# Altium schematic sheet SixAxIMU_XSens.SchDoc
size A4
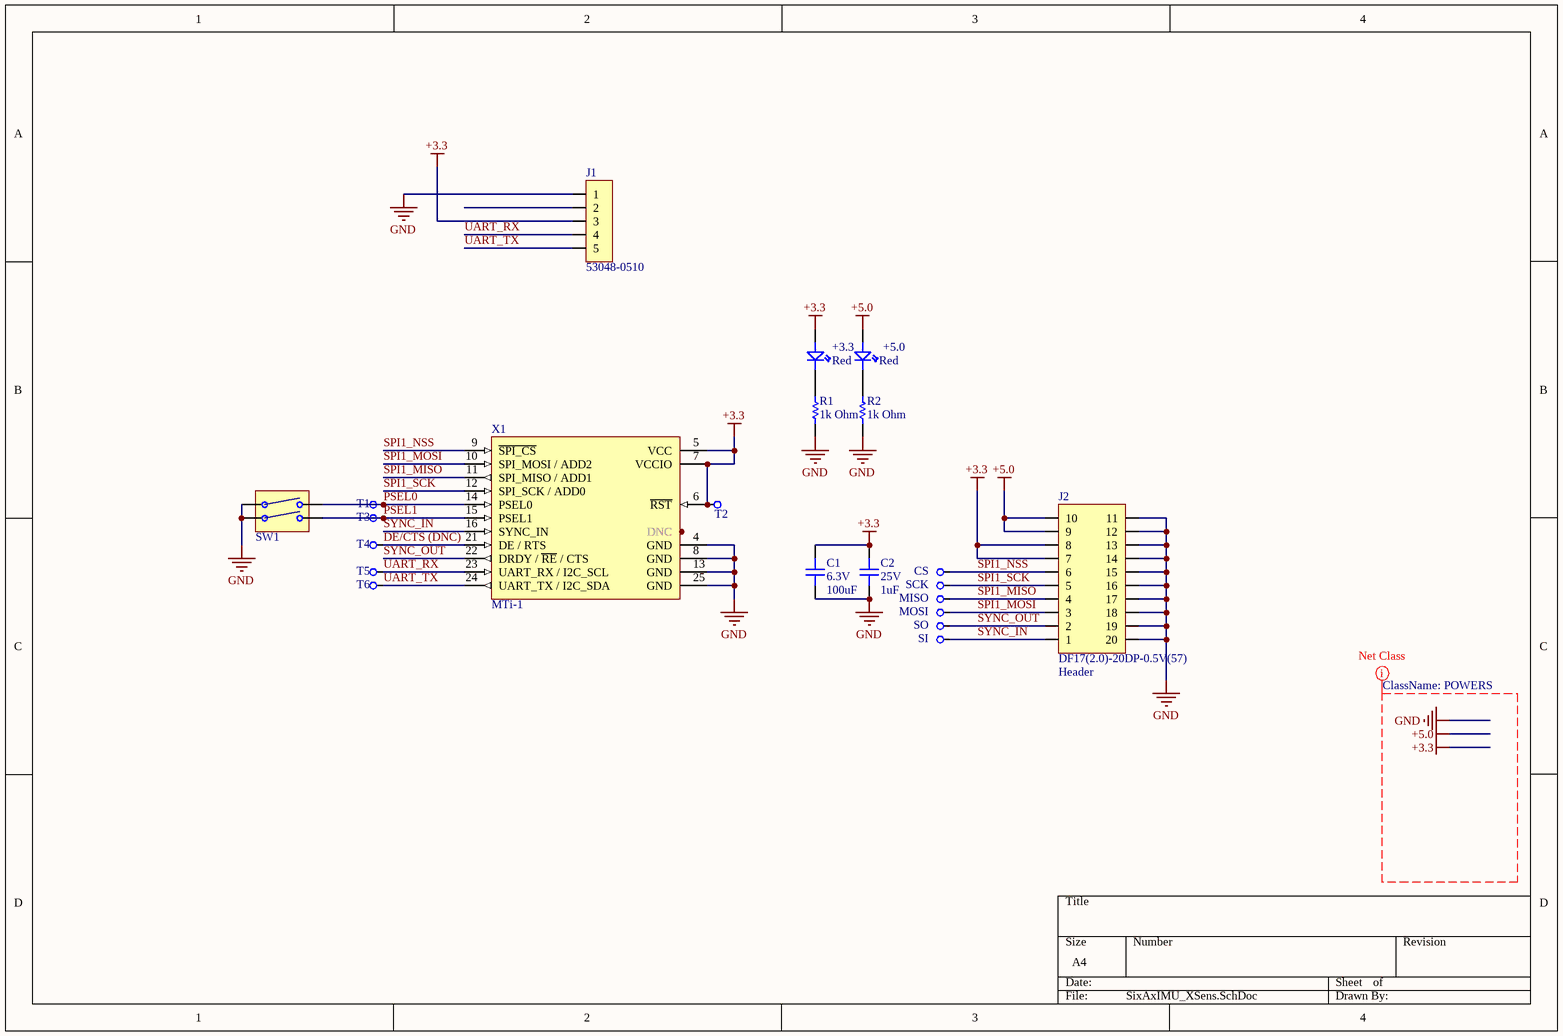
[diagram p0: SixAxIMU_XSens.SchDoc]

## Parts
+3.3  Red  [LED 0603]
+5.0  Red  [LED 0603]
C1  value 100uF  Voltage Rating: 6.3V  [CAP 1206]  (hidden comment: CL31A107MQHNNNE)
C2  value 1uF  Voltage Rating: 25V  [CAP 0603]  (hidden comment: CL10A105KA8NNNC)
CS  TEST  [TEST_0.5mm, SMD]  (value not drawn)
J1  53048-0510  [PicoBlade, 53048-0510]
J2  DF17(2.0)-20DP-0.5V(57)  Type: Header  [DF17(2.0)-20DP-0.5V(57)]
MISO  TEST  [TEST_0.5mm, SMD]  (value not drawn)
MOSI  TEST  [TEST_0.5mm, SMD]  (value not drawn)
R1  value 1k Ohm  [RES 0402]  (hidden comment: P311-1.00KLRTR-ND)
R2  value 1k Ohm  [RES 0402]  (hidden comment: P311-1.00KLRTR-ND)
SCK  TEST  [TEST_0.5mm, SMD]  (value not drawn)
SI  TEST  [TEST_0.5mm, SMD]  (value not drawn)
SO  TEST  [TEST_0.5mm, SMD]  (value not drawn)
SW1  GDH02STR04  [GDH02STR04]  (value not drawn)
T1  TEST  [TEST_0.5mm, SMD]  (value not drawn)
T2  TEST  [TEST_0.5mm, SMD]  (value not drawn)
T3  TEST  [TEST_0.5mm, SMD]  (value not drawn)
T4  TEST  [TEST_0.5mm, SMD]  (value not drawn)
T5  TEST  [TEST_0.5mm, SMD]  (value not drawn)
T6  TEST  [TEST_0.5mm, SMD]  (value not drawn)
X1  MTi-1  [PLCC28 - XSens MTi-1 Special]

## Nets
+3.3: +3.3.A C1.2 C2.2 J1.3 J2.7 J2.8 T2.0 X1.5(VCC) X1.6(~{RST}) X1.7(VCCIO)
+5.0: +5.0.A J2.9 J2.10
GND: C1.1 C2.1 J1.1 J2.11 J2.12 J2.13 J2.14 J2.15 J2.16 J2.17 J2.18 J2.19 J2.20 R1.1 R2.1 SW1.1 SW1.3 X1.4(GND) X1.8(GND) X1.13(GND) X1.25(GND)
DE/CTS (DNC): T4.0 X1.21(DE_/_RTS)
PSEL0: SW1.2 T1.0 X1.14(PSEL0)
PSEL1: SW1.4 T3.0 X1.15(PSEL1)
SPI1_MISO: J2.4 MISO.0 X1.11(SPI_MISO_/_ADD1)
SPI1_MOSI: J2.3 MOSI.0 X1.10(SPI_MOSI_/_ADD2)
SPI1_NSS: CS.0 J2.6 X1.9(~{SPI_CS})
SPI1_SCK: J2.5 SCK.0 X1.12(SPI_SCK_/_ADD0)
SYNC_IN: J2.1 SI.0 X1.16(SYNC_IN)
SYNC_OUT: J2.2 SO.0 X1.22(DRDY_/_~{RE}_/_CTS)
UART_RX: J1.4 T5.0 X1.23(UART_RX_/_I2C_SCL)
UART_TX: J1.5 T6.0 X1.24(UART_TX_/_I2C_SDA)
Net+3.3_K: +3.3.K R1.2
Net+5.0_K: +5.0.K R2.2
NetX1_1: X1.1(DNC) X1.2(DNC) X1.3(DNC) X1.17(DNC) X1.18(DNC) X1.19(DNC) X1.20(DNC) X1.26(DNC) X1.27(DNC) X1.28(DNC)

Not connected (* = marked no-connect by the designer): J1 2

## Layout directives
net class POWERS: +3.3, +5.0, GND

## Library data of the parts
+3.3 +5.0 = 1608SURC-06: LED, Red, 0603; Manufacturer Part Number: 1608SURC-06; ComponentLink1Description: Datasheet; Colour: Red
C1 = CL31A107MQHNNNE: MLCC, 100uF, 1206, 20%, 6.3V, X5R; Manufacturer: Samsung; Temp Range: -55-125°C; Manufacturer Part Number: CL31A107MQHNNNE; ComponentLink1Description: Datasheet; ComponentLink1URL: http://www.samsungsem.com/servlet/ProductSearchView?page=1&searchIdx=1&lang=kr&partnum=1&find_val=CL31A107MQHNNNE; Temp Coefficient: X5R; Tolerance: 20%
C2 = CL10A105KA8NNNC: MLCC, 1uF, 0603, 10%, 25V, X5R; Manufacturer: Samsung; Temp Range: -55-125°C; Manufacturer Part Number: CL10A105KA8NNNC; ComponentLink1Description: Datasheet; ComponentLink1URL: http://www.samsungsem.com/servlet/ProductSearchView?page=1&searchIdx=1&lang=kr&partnum=1&find_val=CL10A105KA8NNNC; Temp Coefficient: X5R; Tolerance: 10%
J1 = 53048-0510: PicoBlade, Header, R/A, PTH, 5 Pos, 1.25mm Pitch; Manufacturer: Molex; Rows: 1; ComponentLink1Description: Datasheet; ComponentLink1URL: http://www.molex.com/molex/products/datasheet.jsp?part=active/0530480510_PCB_HEADERS.xml; ManufacturerPartNumber: 53048-0510; Pins: 5; Pitch: 1.25mm; Series: PicoBlade
J2 = DF17(2.0)-20DP-0.5V(57): Conn, B2B, 20 Pos, HEADER; Manufacturer: Hirose; Manufacturer Part Number: DF17(2.0)-20DP-0.5V(57); ComponentLink1Description: Datasheet; ComponentLink1URL: http://www.mouser.com/ds/2/185/en_DF17_20130411-253728.pdf; Tolerance: *
R1 R2 = P311-1.00KLRTR-ND: RES, 0402, 1k, 1%; Manufacturer: Yageo; Power: 63mW; Manufacturer Part Number: P311-1.00KLRTR-ND; ComponentLink1Description: Datasheet; ComponentLink1URL: http://www.yageo.com/NewPortal/_en/search/productDocs.jsp?YageoPartNumber=P311-1.00KLRTR-ND; Tolerance: 1%
SW1 = GDH02STR04: DIP Switch, 2 POS, SMD; Manufacturer: TE Connectivity; Manufacturer Part Number: GDH02STR04; ComponentLink1Description: Datasheet; ComponentLink1URL: http://www.mouser.com/ds/2/418/NG_CD_1571983_C3-685641.pdf; Tolerance: *
X1 = MTi-1: XSens MTi-1 Series; Manufacturer: XSens; Manufacturer Part Number: MTi-1; ComponentLink1Description: Datasheet; ComponentLink1URL: https://www.xsens.com/products/mti-1-series/?page_id=functions/mti-1/; Tolerance: *
CS MISO MOSI SCK SI SO T1-T6 = TEST: ComponentLink1Description: Datasheet